# EAGLE design pc-gen-usb-vargain (EAGLE 6.4)
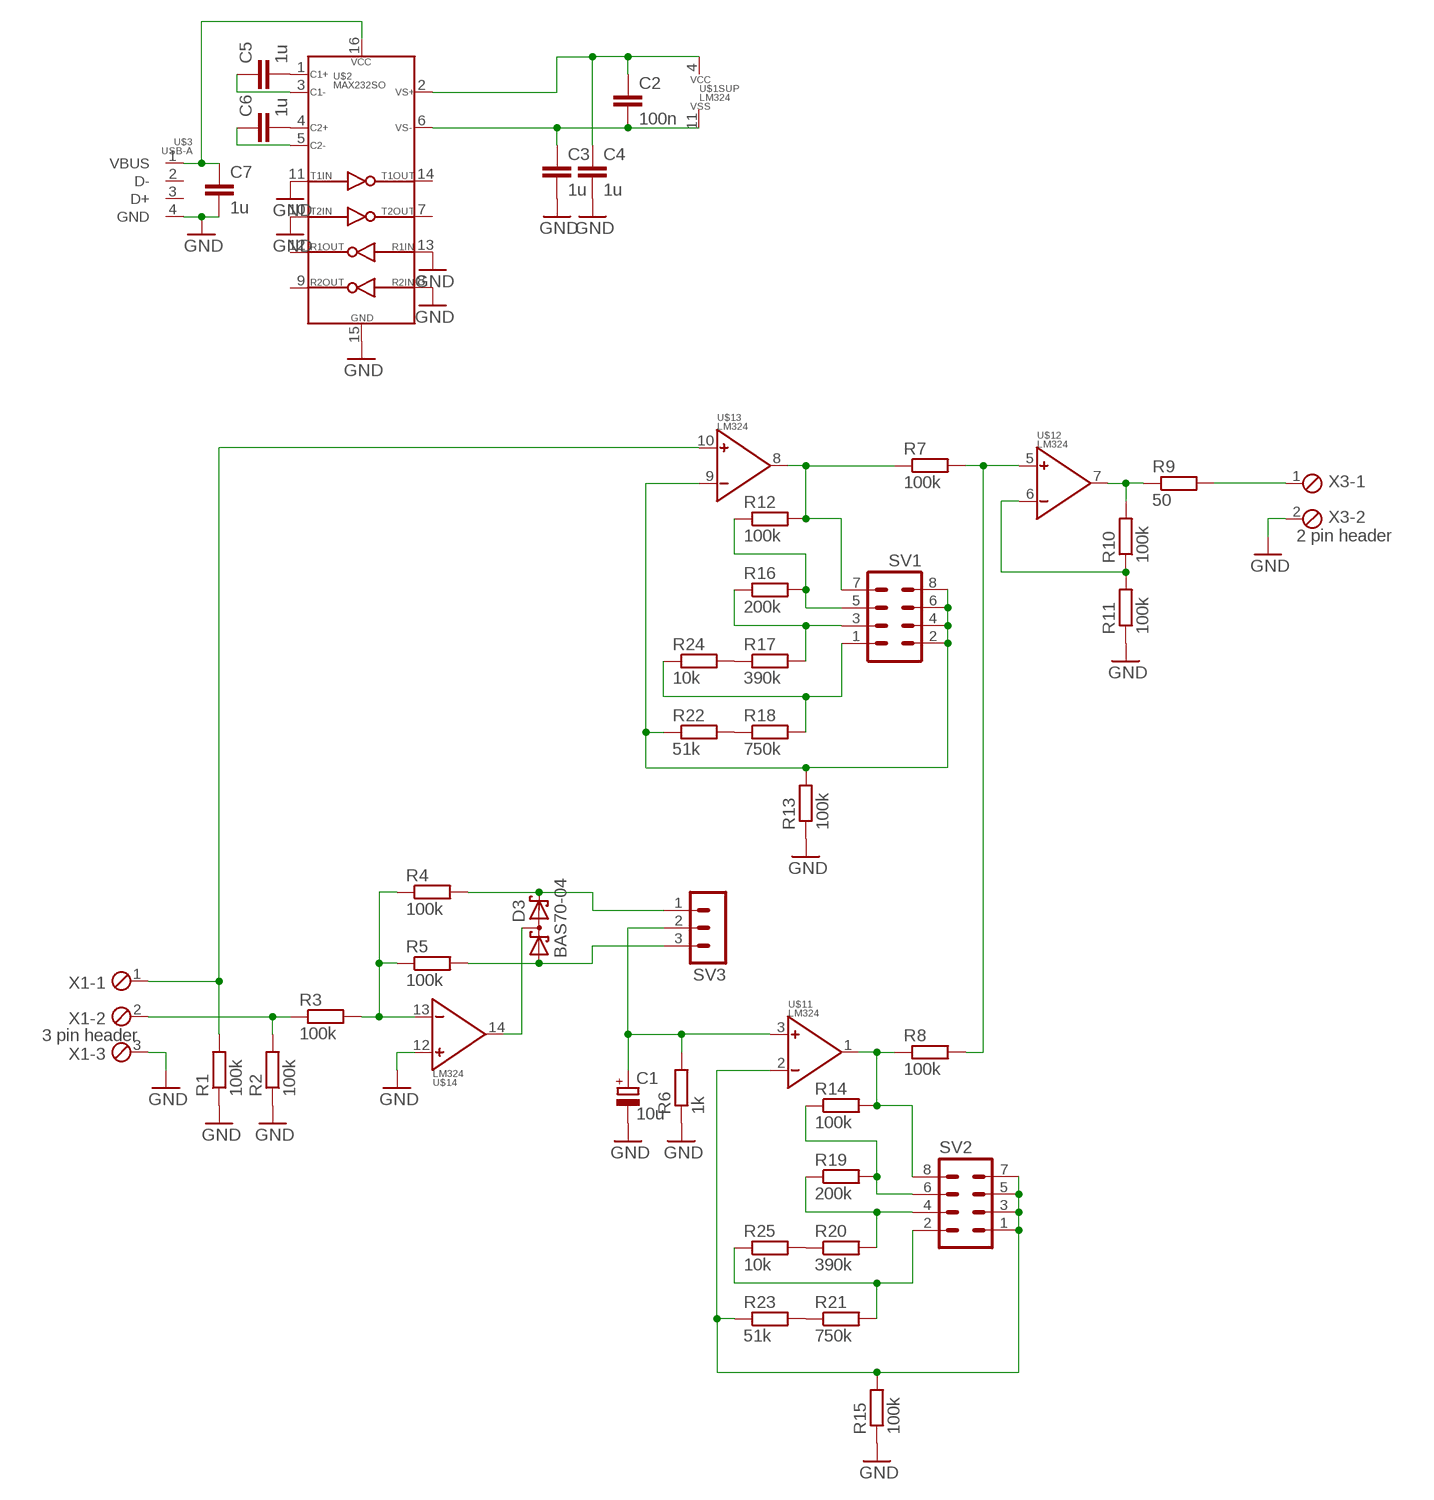
[diagram p0: schematic, sheet 1]

## Parts
C1  10u  CPOL-EUE2.5-7  [E2,5-7]
C2  100n  C-EUC1206  [C1206]
C3  1u  C-EUC1206  [C1206]
C4  1u  C-EUC1206  [C1206]
C5  1u  C-EUC1206  [C1206]
C6  1u  C-EUC1206  [C1206]
C7  1u  C-EUC1206  [C1206]
D3  BAS70-04  [SOT23]
R1  100k  R-EU_R1206  [R1206]
R2  100k  R-EU_R1206  [R1206]
R3  100k  R-EU_R1206  [R1206]
R4  100k  R-EU_R1206  [R1206]
R5  100k  R-EU_R1206  [R1206]
R6  1k  R-EU_R1206  [R1206]
R7  100k  R-EU_R1206  [R1206]
R8  100k  R-EU_R1206  [R1206]
R9  50  R-EU_R1206  [R1206]
R10  100k  R-EU_R1206  [R1206]
R11  100k  R-EU_R1206  [R1206]
R12  100k  R-EU_R1206  [R1206]
R13  100k  R-EU_R1206  [R1206]
R14  100k  R-EU_R1206  [R1206]
R15  100k  R-EU_R1206  [R1206]
R16  200k  R-EU_R1206  [R1206]
R17  390k  R-EU_R1206  [R1206]
R18  750k  R-EU_R1206  [R1206]
R19  200k  R-EU_R1206  [R1206]
R20  390k  R-EU_R1206  [R1206]
R21  750k  R-EU_R1206  [R1206]
R22  51k  R-EU_R1206  [R1206]
R23  51k  R-EU_R1206  [R1206]
R24  10k  R-EU_R1206  [R1206]
R25  10k  R-EU_R1206  [R1206]
SV1  MA04-2  [MA04-2]
SV2  MA04-2  [MA04-2]
SV3  MA03-1  [MA03-1]
U$1  LM324  OP-QUADSO14  [SO14]
U$2  MAX232SO  [SO16]
U$3  USB-A  [USB-A]
X1  3 pin header  MPT3  [3POL254]
X3  2 pin header  MPT2  [2POL254]

## Nets
GND: C1.- C3.2 C4.2 C7.2 R1.1 R2.1 R6.1 R11.1 R13.1 R15.1 U$1.12(4:POS) U$2.8(R2IN) U$2.10(T2IN) U$2.11(T1IN) U$2.13(R1IN) U$2.15(GND) U$3.4(GND) X1.3 X3.2
N$1: C2.2 C3.1 U$1.11(SUP:VSS) U$2.6(VS-)
N$2: C2.1 C4.1 U$1.4(SUP:VCC) U$2.2(VS+)
N$3: R2.2 R3.1 X1.2
N$4: R1.2 U$1.10(3:POS) X1.1
N$5: R16.1 R17.2 SV1.3
N$6: R3.2 R4.1 R5.1 U$1.13(4:NEG)
N$7: D3.1(A1) R5.2 SV3.3
N$8: R7.1 R12.2 SV1.7 U$1.8(3:OUT)
N$9: D3.3(C1A2) U$1.14(4:OUT)
N$10: R8.1 R14.2 SV2.8 U$1.1(1:OUT)
N$11: C1.+ R6.2 SV3.2 U$1.3(1:POS)
N$12: R18.2 R24.1 SV1.1
N$13: R7.2 R8.2 U$1.5(2:POS)
N$14: R9.2 X3.1
N$15: R9.1 R10.2 U$1.7(2:OUT)
N$16: R10.1 R11.2 U$1.6(2:NEG)
N$17: R12.1 R16.2 SV1.5
N$18: C7.1 U$2.16(VCC) U$3.1(VBUS)
N$19: C5.2 U$2.1(C1+)
N$20: C6.2 U$2.4(C2+)
N$21: C5.1 U$2.3(C1-)
N$22: C6.1 U$2.5(C2-)
N$23: R15.2 R23.1 SV2.1 SV2.3 SV2.5 SV2.7 U$1.2(1:NEG)
N$24: R19.1 R20.2 SV2.4
N$25: R21.2 R25.1 SV2.2
N$26: R14.1 R19.2 SV2.6
N$27: R21.1 R23.2
N$28: R20.1 R25.2
N$29: R13.2 R22.1 SV1.2 SV1.4 SV1.6 SV1.8 U$1.9(3:NEG)
N$30: R18.1 R22.2
N$31: R17.1 R24.2
N$32: D3.2(C2) R4.2 SV3.1
Unconnected: U$2.7(T2OUT) U$2.9(R2OUT) U$2.12(R1OUT) U$2.14(T1OUT) U$3.2(D-) U$3.3(D+)

## Library data of the parts
C1 = rcl:CPOL-EU: POLARIZED CAPACITOR, European symbol
C2-C7 = rcl:C-EU: CAPACITOR, European symbol
D3 = diode:BAS70-04: Silicon Schottky Diodes General-purpose diode for high-speed switching
R1-R25 = rcl:R-EU_: RESISTOR, European symbol
SV1 SV2 = con-lstb:MA04-2: PIN HEADER; OC_FARNELL: unknown; OC_NEWARK: unknown
SV3 = con-lstb:MA03-1: PIN HEADER; OC_FARNELL: unknown; OC_NEWARK: unknown
U$1 = pc-gen:OP-QUAD
U$2 = pc-gen:MAX232
U$3 = pc-gen:USB-A
X1 = con-phoenix-254:MPT3: PHOENIX CONNECTOR; OC_FARNELL: unknown; OC_NEWARK: unknown
X3 = con-phoenix-254:MPT2: PHOENIX CONNECTOR; OC_FARNELL: unknown; OC_NEWARK: unknown

## Board
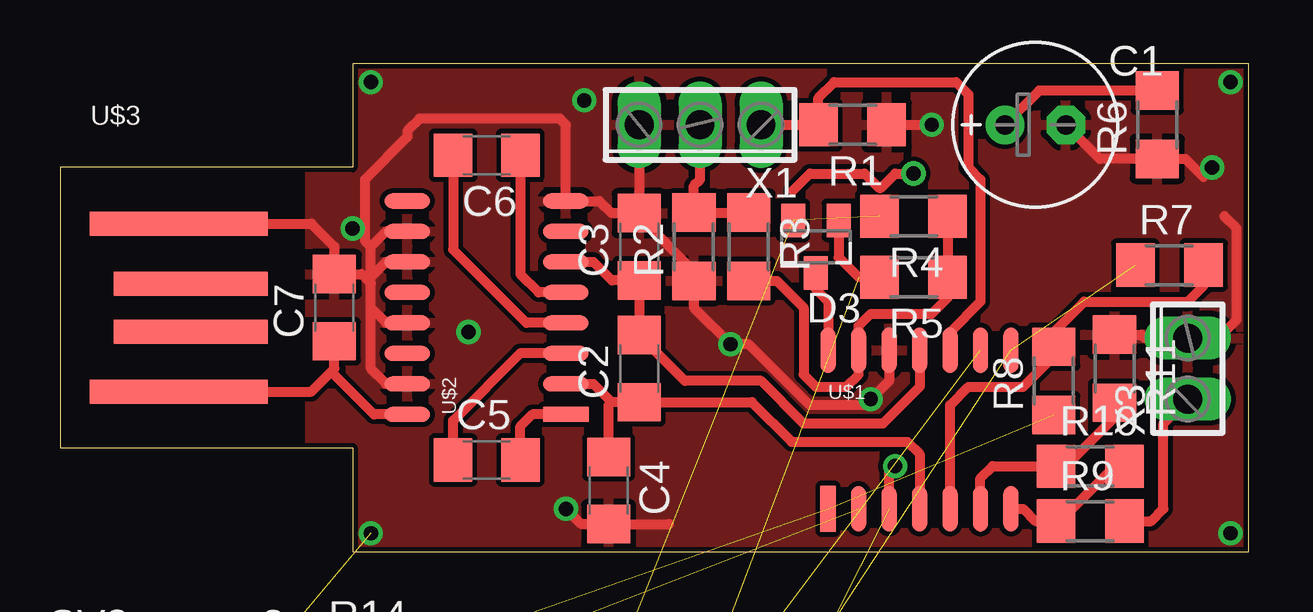
[diagram p1: board, top side]
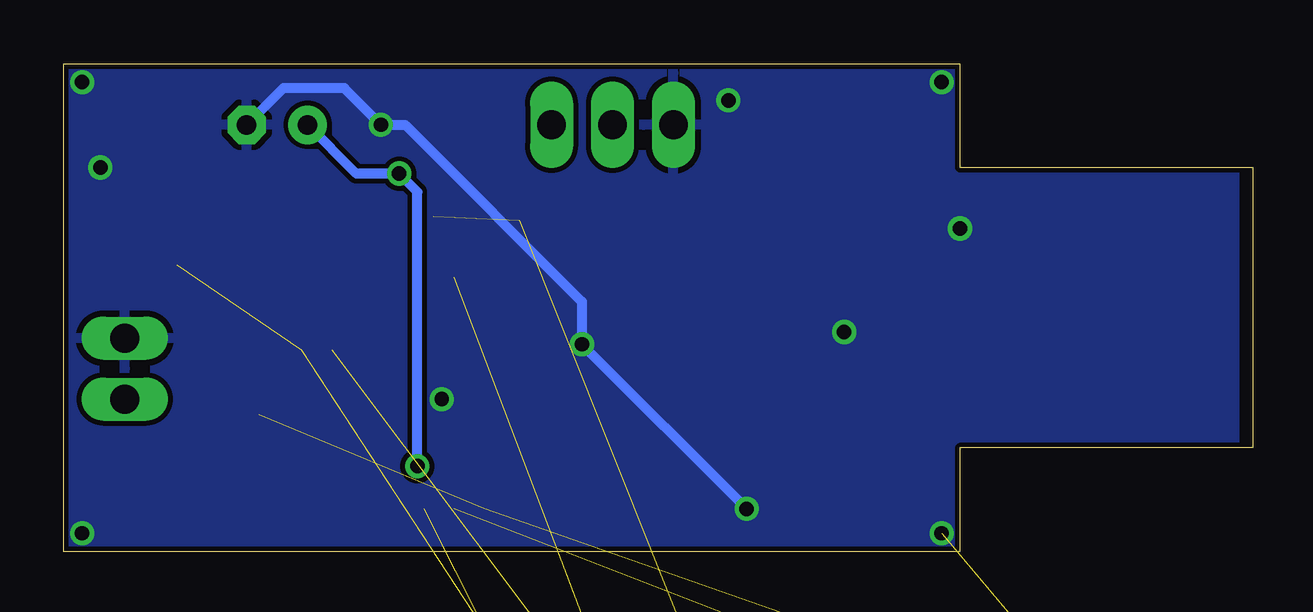
[diagram p2: board, bottom side, seen from below]

Size 49.53 x 20.32 mm. Coordinates in mm from the lower left corner, seen from the top.
Outline: 12.19,0 49.53,0 49.53,20.32 12.19,20.32 12.19,16 0,16 0,4.32 12.19,4.32 12.19,0
Copper layers (1*16): Top 0.035mm / dielectric 1.5mm / Bottom 0.035mm
Design rules "default *": minimum track width 10mil, minimum drill 20mil, track to track 8mil, track to pad 8mil, pad to pad 8mil, via to via 8mil, smd to smd 8mil, copper to edge 8mil, drill to drill 8mil, minimum pad ring 10mil, minimum via ring 8mil, stop-mask expansion 4mil, vias tented up to drill 0mil, thermal gap 10mil

### Footprints (pad centres in the part's own frame; a part is rotated, then mirrored left to right if it is on the bottom)
E2,5-7 = drill 0.813 pad 1.6: + -1.27,0 | drill 0.813 pad 1.6 octagon: - 1.27,0
C1206 = smd 1.6 x 1.8: 1 -1.4,0; 2 1.4,0
SOT23 = smd 1 x 1.4: 1 -0.95,-1.1; 2 0.95,-1.1; 3 0,1.1
R1206 = smd 1.6 x 1.803: 1 -1.422,0; 2 1.422,0
MA04-2 = drill 1.016 octagon: 1 -3.81,-1.27; 2 -3.81,1.27; 3 -1.27,-1.27; 4 -1.27,1.27; 5 1.27,-1.27; 6 1.27,1.27; 7 3.81,-1.27; 8 3.81,1.27
MA03-1 = drill 1.016 long: 1 -2.54,0; 2 0,0; 3 2.54,0
SO14 = smd 0.635 x 1.905: 1 -3.81,-3.302; 2 -2.54,-3.302; 3 -1.27,-3.302; 4 0,-3.302; 5 1.27,-3.302; 6 2.54,-3.302; 7 3.81,-3.302; 8 3.81,3.302; 9 2.54,3.302; 10 1.27,3.302; 11 0,3.302; 12 -1.27,3.302; 13 -2.54,3.302; 14 -3.81,3.302
SO16 = smd 0.635 x 1.905: 1 -4.445,-3.302; 2 -3.175,-3.302; 3 -1.905,-3.302; 4 -0.635,-3.302; 5 0.635,-3.302; 6 1.905,-3.302; 7 3.175,-3.302; 8 4.445,-3.302; 9 4.445,3.302; 10 3.175,3.302; 11 1.905,3.302; 12 0.635,3.302; 13 -0.635,3.302; 14 -1.905,3.302; 15 -3.175,3.302; 16 -4.445,3.302
USB-A = smd 7.41 x 1: 1 4.954,-3.5; 4 4.954,3.5 | smd 6.41 x 1: 2 5.445,-1; 3 5.445,1
3POL254 = drill 1.2 long: 1 -2.54,0; 2 0,0; 3 2.54,0
2POL254 = drill 1.2 long: 1 -1.27,0; 2 1.27,0

### Placement (x,y rotation side)
C1  40.64,17.78 0 top
C2  24.13,7.62 90 top
C3  24.13,12.7 90 top
C4  22.86,2.54 270 top
C5  17.78,3.81 0 top
C6  17.78,16.51 180 top
C7  11.43,10.16 90 top
D3  31.5,12.7 180 top
R1  33.02,17.78 180 top
R2  26.42,12.7 90 top
R3  28.7,12.7 270 top
R4  35.56,13.97 180 top
R5  35.56,11.43 180 top
R6  45.72,17.78 90 top
R7  46.23,11.94 0 top
R8  41.4,7.11 90 top
R9  42.93,1.27 0 top
R10  42.93,3.56 0 top
R11  43.94,7.62 270 top
R12  12.45,-30.99 0 top  (outside the outline)
R13  10.41,-51.82 0 top  (outside the outline)
R14  12.45,-4.57 0 top  (outside the outline)
R15  1.78,-14.22 0 top  (outside the outline)
R16  1.78,-40.39 0 top  (outside the outline)
R17  8.89,-40.39 0 top  (outside the outline)
R18  1.78,-45.97 0 top  (outside the outline)
R19  8.89,-14.22 0 top  (outside the outline)
R20  1.78,-19.81 0 top  (outside the outline)
R21  8.89,-19.81 0 top  (outside the outline)
R22  8.89,-45.97 0 top  (outside the outline)
R23  1.78,-25.4 0 top  (outside the outline)
R24  1.78,-51.56 0 top  (outside the outline)
R25  8.13,-25.4 0 top  (outside the outline)
SV1  4.57,-32.77 0 top  (outside the outline)
SV2  4.57,-6.6 0 top  (outside the outline)
SV3  4.57,-57.66 0 top  (outside the outline)
U$1  35.81,5.08 0 top
U$2  17.78,10.16 90 top
U$3  0,10.16 0 top
X1  26.67,17.78 180 top
X3  46.99,7.62 90 top

### Tracks (layer width: path | path; a pad name or v marks a point on that pad's centre or on a via)
GND  (via drill 0.6)  (2 unrouted)
  Top 0.406: U$3.4 10.47,13.66 11.43,12.7 C7.2 12.57,11.56 12.95,11.18 | U$2.15 13.59,6.99 12.95,7.62 12.95,10.16 | 12.95,10.16 12.95,11.18 | 12.95,11.18 12.95,11.43 | 12.95,11.43 12.95,12.7 | U$2.10 13.59,13.34 12.95,12.7 | U$2.13 13.59,9.53 12.95,10.16 | U$2.11 13.59,12.06 12.95,11.43 | 25.38,1.14 C4.2 21.72,1.14 v21.08,1.78 | X1.3 C3.2 | C3.2 22.98,14.1 22.48,14.61 U$2.8 21.08,17.78 20.83,18.03 14.99,18.03 14.48,17.53 14.48,17.27 12.7,15.49 12.7,12.95 12.95,12.7 | U$1.12 34.54,7.11 33.53,6.1 31.24,6.1 28.7,8.64 v27.94,8.64 26.42,10.16 R2.1 26.42,11.68 24.13,13.97 C3.2 | 48.51,13.97 49.02,13.46 49.02,9.65 48.26,8.89 X3.2 45.21,8.89 45.06,9.04 R11.1 | 47.65,15.6 46.89,16.36 R6.1 43.33,16.36 C1.- | R1.1 v36.32,17.78
  Bottom 0.406: C1.- 40.39,19.3 37.85,19.3 v36.32,17.78 35.31,17.78 27.94,10.41 v27.94,8.64 v21.08,1.78
  other vias: 12.95,0.76 12.95,19.56 48.77,19.56 21.84,18.8 12.19,13.46 17.02,9.14 48.01,16 33.78,6.35 48.77,0.76
  pour Bottom: 12.45,20.07 12.45,15.75 0.76,15.75 0.76,4.57 12.45,4.57 12.45,0.25 49.28,0.25 49.28,20.07
  pour Top: 12.45,20.07 12.45,15.75 10.41,15.75 10.41,4.57 12.45,4.57 12.45,0.25 49.28,0.25 49.28,20.07
N$1
  Top 0.406: U$2.6 22.23,12.06 22.99,11.3 C3.1 C2.2 26.04,7.11 29.21,7.11 30.99,5.33 34.29,5.33 35.81,6.86 U$1.11
N$2
  Top 0.406: U$2.2 22.23,6.99 22.99,6.22 | 22.99,6.22 C2.1 28.83,6.22 30.48,4.57 35.31,4.57 35.81,4.06 U$1.4 | C4.1 22.86,6.09 22.99,6.22
N$3
  Top 0.406: X1.2 26.67,15.49 26.42,15.24 R2.2 R3.1
N$4
  Top 0.406: X1.1 R1.2 31.6,18.9 32.26,19.56 37.34,19.56 37.85,19.05 37.85,16 38.35,15.49 38.35,10.41 37.08,9.14 U$1.10
N$5  (2 unrouted)
N$6
  Top 0.406: R4.1 R5.1 36.98,10.57 36.32,9.91 33.78,9.91 33.27,9.4 U$1.13 33.27,7.37 32.77,6.86 31.5,6.86 30.99,7.37 30.99,10.16 29.87,11.28 R3.2
N$7  (1 unrouted)
  Top 0.406: R5.2 33.27,11.43 32.45,12.26 D3.1
N$8  (3 unrouted)
N$9
  Top 0.406: U$1.14 32,10.41 31.5,10.92 D3.3
N$10  (3 unrouted)
N$11  (via drill 0.6)  (1 unrouted)
  Top 0.406: R6.2 40.79,19.2 C1.+ | v35.56,15.75 34.8,15.75 34.19,15.14 34.14,15.14 33.53,15.75 31.24,15.75 30.55,15.05 | U$1.3 34.54,3.3 v34.8,3.56
  Bottom 0.406: C1.+ 37.34,15.75 v35.56,15.75 34.8,14.99 v34.8,3.56
N$12  (2 unrouted)
N$13
  Top 0.406: U$1.5 37.08,6.1 37.85,6.86 40.13,6.86 41.4,8.13 R8.2 41.4,9.14 42.67,10.41 46.99,10.41 47.65,11.07 R7.2
N$14
  Top 0.406: R9.2 45.47,1.27 45.97,1.78 45.97,5.33 X3.1
N$15
  Top 0.406: U$1.7 40.13,1.78 40.64,1.27 R9.1 41.66,1.27 43.94,3.56 R10.2
N$16
  Top 0.406: U$1.6 38.35,3.05 38.86,3.56 R10.1 41.91,3.56 43.94,5.59 R11.2
N$17  (2 unrouted)
N$18
  Top 0.406: U$3.1 10.47,6.66 11.3,7.49 | 11.3,7.49 11.43,7.62 C7.1 | U$2.16 13.08,5.71 11.3,7.49
N$19
  Top 0.406: C5.2 19.18,5.21 19.68,5.71 U$2.1
N$20
  Top 0.406: U$2.4 19.43,9.53 16.38,12.58 C6.2
N$21
  Top 0.406: U$2.3 19.18,8.26 16.38,5.46 C5.1
N$22
  Top 0.406: U$2.5 19.94,10.79 19.18,11.55 C6.1
N$23  (6 unrouted)
N$24  (2 unrouted)
N$25  (2 unrouted)
N$26  (2 unrouted)
N$27  (1 unrouted)
N$28  (1 unrouted)
N$29  (6 unrouted)
N$30  (1 unrouted)
N$31  (1 unrouted)
N$32  (2 unrouted)

### Text on the board
tStop: LuXeria | pc-gen | daniw